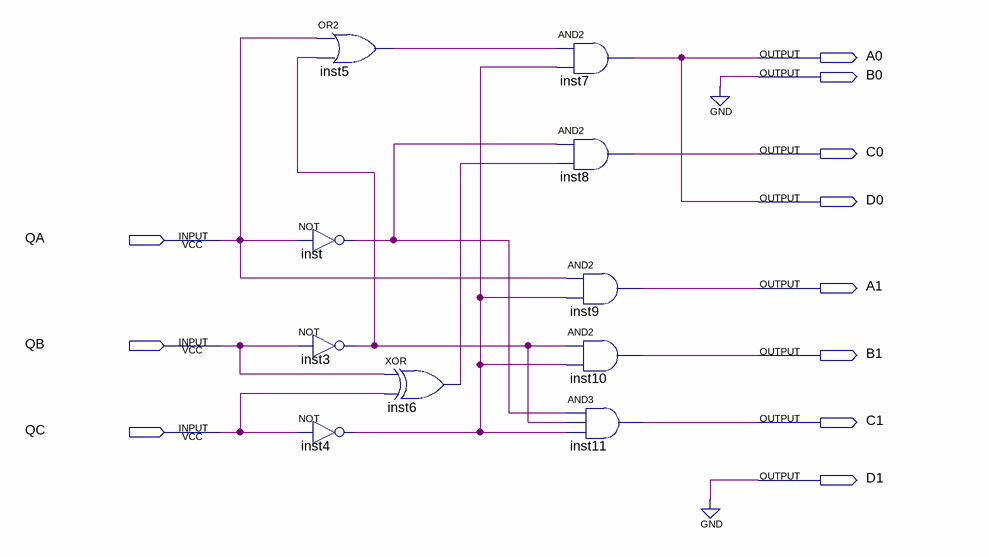
[diagram p0: schematic sheet]
// Quartus schematic Block3.bdf as structural Verilog: 10 symbols, 11 pins
module Block3 (
  input  QA,
  input  QB,
  input  QC,
  output A0,
  output B0,
  output C0,
  output D0,
  output A1,
  output B1,
  output C1,
  output D1
);

  wire inst3_out, inst4_out, inst5_out, inst6_out, inst_out;

  or inst5 (inst5_out, QA, inst3_out);
  not inst (inst_out, QA);
  not inst3 (inst3_out, QB);
  not inst4 (inst4_out, QC);
  xor inst6 (inst6_out, QB, QC);
  and inst7 (A0, inst5_out, inst4_out);
  and inst8 (C0, inst_out, inst6_out);
  and inst9 (A1, QA, inst4_out);
  and inst10 (B1, inst3_out, inst4_out);
  and inst11 (C1, inst_out, inst3_out, inst4_out);

  assign B0 = 1'b0;
  assign D0 = A0;
  assign D1 = 1'b0;
endmodule
